# Altium project ARM_V2.PrjPcb
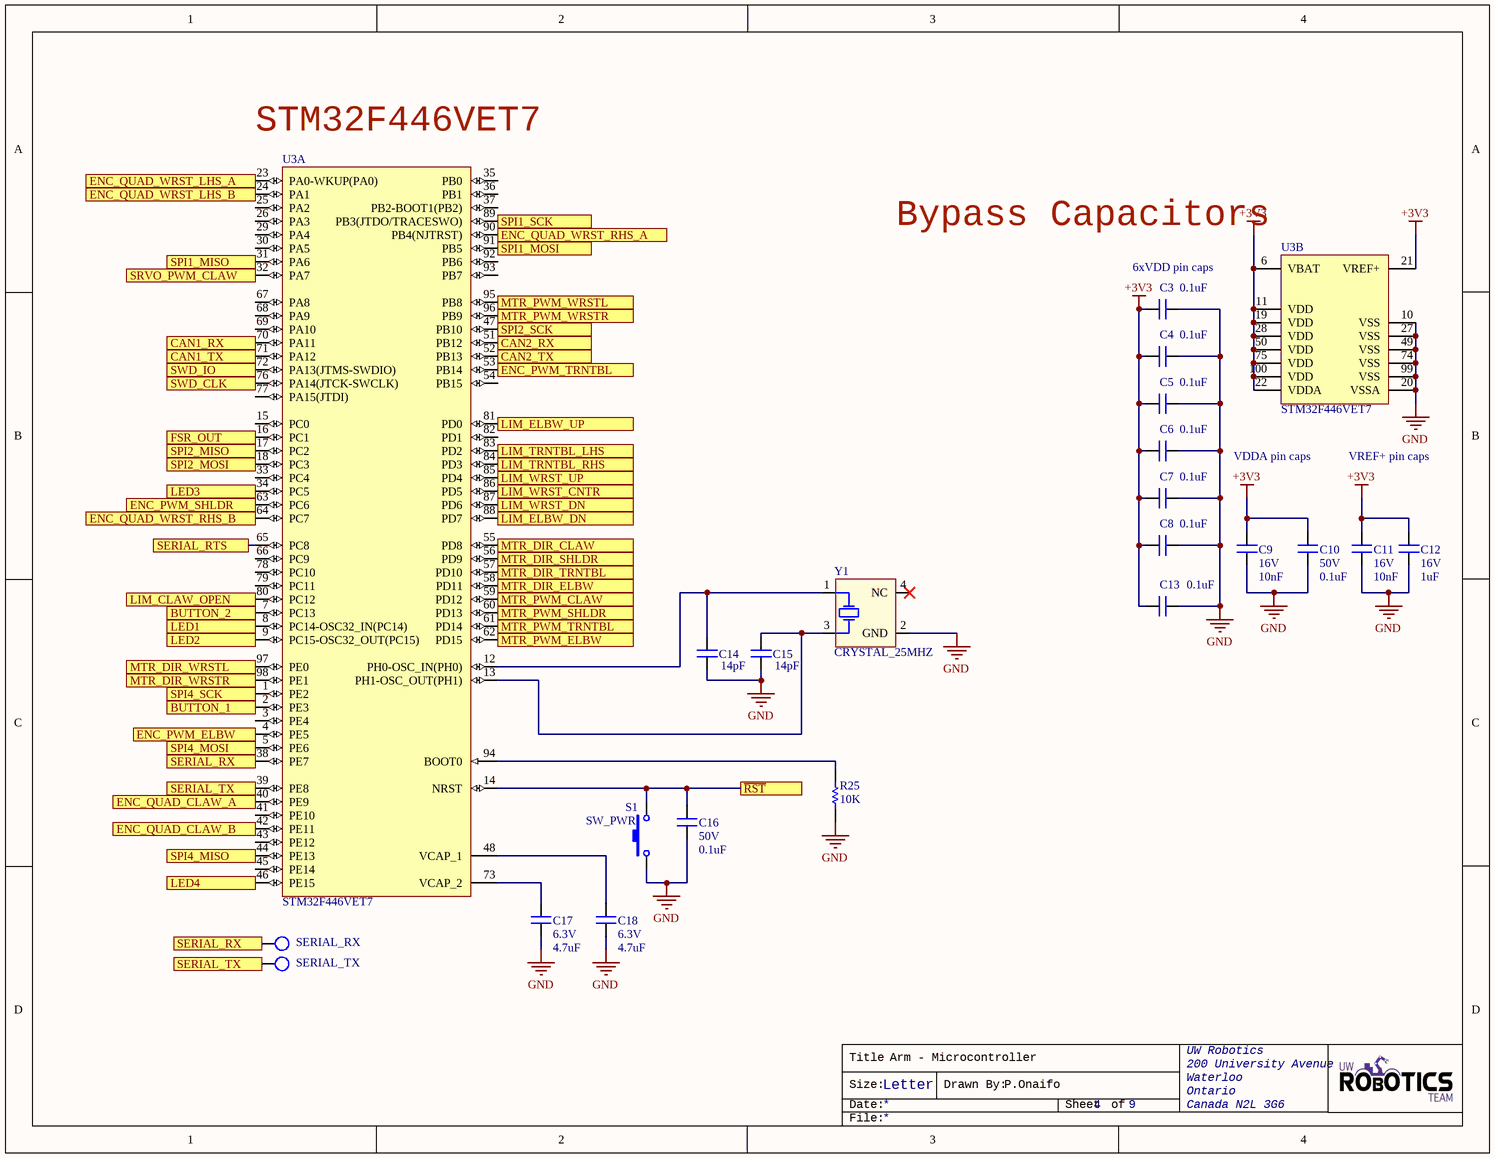
[diagram p0: MCU.SchDoc]
2 sheets, 28 parts. Net scope: flat (ports and power ports of the same name join across sheets).
Board file: ARM_V2.PcbDoc
Sheets:
  MCU.SchDoc
  Integrated Connectors.SchDoc

## Sheet MCU.SchDoc: Arm - Microcontroller
size Letter; DrawnBy: P.Onaifo; Organization: UW Robotics; Address1: 200 University Avenue; Address2: Waterloo; Address3: Ontario; Address4: Canada N2L 3G6; SheetNumber: 4; SheetTotal: 9

### Parts
C3  value 0.1uF  [CAPC0603(1608)55_N]  (hidden comment: CAP_0.1uF_50V_0603)
C4  value 0.1uF  [CAPC0603(1608)55_N]  (hidden comment: CAP_0.1uF_50V_0603)
C5  value 0.1uF  [CAPC0603(1608)55_N]  (hidden comment: CAP_0.1uF_50V_0603)
C6  value 0.1uF  [CAPC0603(1608)55_N]  (hidden comment: CAP_0.1uF_50V_0603)
C7  value 0.1uF  [CAPC0603(1608)55_N]  (hidden comment: CAP_0.1uF_50V_0603)
C8  value 0.1uF  [CAPC0603(1608)55_N]  (hidden comment: CAP_0.1uF_50V_0603)
C9  value 10nF  Voltage Rating: 16V  [CAPC0603(1608)55_N]  (hidden comment: CAP_10nF_0603)
C10  value 0.1uF  Voltage Rating: 50V  [CAPC0603(1608)55_N]  (hidden comment: CAP_0.1uF_50V_0603)
C11  value 10nF  Voltage Rating: 16V  [CAPC0603(1608)55_N]  (hidden comment: CAP_10nF_0603)
C12  value 1uF  Voltage Rating: 16V  [CAPC0603(1608)55_N]  (hidden comment: CAP_1uF_16V_0603)
C13  value 0.1uF  [CAPC0603(1608)55_N]  (hidden comment: CAP_0.1uF_50V_0603)
C14  value 14pF  (hidden comment: CAP_14pF_50V_0603)
C15  value 14pF  (hidden comment: CAP_14pF_50V_0603)
C16  value 0.1uF  Voltage Rating: 50V  [CAPC0603(1608)55_N]  (hidden comment: CAP_0.1uF_50V_0603)
C17  value 4.7uF  Voltage Rating: 6.3V  [CAPC0603(1608)55_N]  (hidden comment: CAP_4.7uF_0603)
C18  value 4.7uF  Voltage Rating: 6.3V  [CAPC0603(1608)55_N]  (hidden comment: CAP_4.7uF_0603)
R25  value 10K  [RESC0603(1608)_N]  (hidden comment: RES_10K_0603)
S1  SW_PWR  [PTS830GM140]
SERIAL_RX  TESTPOINT_LOOP  [TESTPOINT_LOOP]  (value not drawn)
SERIAL_TX  TESTPOINT_LOOP  [TESTPOINT_LOOP]  (value not drawn)
U3  STM32F446VET7  [STM-LQFP100_L]  (parts A,B of 2)
Y1  CRYSTAL_25MHZ

### Ports
BUTTON_1, BUTTON_2, CAN1_RX, CAN1_TX, CAN2_RX, CAN2_TX, ENC_PWM_ELBW, ENC_PWM_SHLDR, ENC_PWM_TRNTBL, ENC_QUAD_CLAW_A, ENC_QUAD_CLAW_B, ENC_QUAD_WRST_LHS_A, ENC_QUAD_WRST_LHS_B, ENC_QUAD_WRST_RHS_A, ENC_QUAD_WRST_RHS_B, FSR_OUT, LED1, LED2, LED3, LED4, LIM_CLAW_OPEN, LIM_ELBW_DN, LIM_ELBW_UP, LIM_TRNTBL_LHS, LIM_TRNTBL_RHS, LIM_WRST_CNTR, LIM_WRST_DN, LIM_WRST_UP, MTR_DIR_CLAW, MTR_DIR_ELBW, MTR_DIR_SHLDR, MTR_DIR_TRNTBL, MTR_DIR_WRSTL, MTR_DIR_WRSTR, MTR_PWM_CLAW, MTR_PWM_ELBW, MTR_PWM_SHLDR, MTR_PWM_TRNTBL, MTR_PWM_WRSTL, MTR_PWM_WRSTR, SERIAL_RTS, SERIAL_RX, SERIAL_TX, SPI1_MISO, SPI1_MOSI, SPI1_SCK, SPI2_MISO, SPI2_MOSI, SPI2_SCK, SPI4_MISO, SPI4_MOSI, SPI4_SCK, SRVO_PWM_CLAW, SWD_CLK, SWD_IO, ~{RST}

### Nets
+3V3: C3.1 C4.1 C5.1 C6.1 C7.1 C8.1 C9.2 C10.2 C11.1 C12.2 C13.1 U3.6(VBAT) U3.11(VDD) U3.19(VDD) U3.21(VREF+) U3.22(VDDA) U3.28(VDD) U3.50(VDD) U3.75(VDD) U3.100(VDD)
GND: C3.2 C4.2 C5.2 C6.2 C7.2 C8.2 C9.1 C10.1 C11.2 C12.1 C13.2 C14.1 C15.1 C16.1 C17.1 C18.1 R25.2 S1.1 U3.10(VSS) U3.20(VSSA) U3.27(VSS) U3.49(VSS) U3.74(VSS) U3.99(VSS) Y1.2(GND)
NetC14_2: C14.2 U3.12(PH0-OSC_IN(PH0)) Y1.1(HOT)
NetC15_2: C15.2 U3.13(PH1-OSC_OUT(PH1)) Y1.3(HOT)
NetC16_2: C16.2 S1.2 U3.14(NRST) ; port ~{RST}
NetC17_2: C17.2 U3.73(VCAP_2)
NetC18_2: C18.2 U3.48(VCAP_1)
NetR25_1: R25.1 U3.94(BOOT0)
NetSERIAL_RX_1: SERIAL_RX.1 U3.38(PE7) ; port SERIAL_RX
NetSERIAL_TX_1: SERIAL_TX.1 U3.39(PE8) ; port SERIAL_TX
NetU3_1: U3.1(PE2) ; port SPI4_SCK
NetU3_2: U3.2(PE3) ; port BUTTON_1
NetU3_4: U3.4(PE5) ; port ENC_PWM_ELBW
NetU3_5: U3.5(PE6) ; port SPI4_MOSI
NetU3_7: U3.7(PC13) ; port BUTTON_2
NetU3_8: U3.8(PC14-OSC32_IN(PC14)) ; port LED1
NetU3_9: U3.9(PC15-OSC32_OUT(PC15)) ; port LED2
NetU3_16: U3.16(PC1) ; port FSR_OUT
NetU3_17: U3.17(PC2) ; port SPI2_MISO
NetU3_18: U3.18(PC3) ; port SPI2_MOSI
NetU3_23: U3.23(PA0-WKUP(PA0)) ; port ENC_QUAD_WRST_LHS_A
NetU3_24: U3.24(PA1) ; port ENC_QUAD_WRST_LHS_B
NetU3_31: U3.31(PA6) ; port SPI1_MISO
NetU3_32: U3.32(PA7) ; port SRVO_PWM_CLAW
NetU3_34: U3.34(PC5) ; port LED3
NetU3_40: U3.40(PE9) ; port ENC_QUAD_CLAW_A
NetU3_42: U3.42(PE11) ; port ENC_QUAD_CLAW_B
NetU3_44: U3.44(PE13) ; port SPI4_MISO
NetU3_46: U3.46(PE15) ; port LED4
NetU3_47: U3.47(PB10) ; port SPI2_SCK
NetU3_51: U3.51(PB12) ; port CAN2_RX
NetU3_52: U3.52(PB13) ; port CAN2_TX
NetU3_53: U3.53(PB14) ; port ENC_PWM_TRNTBL
NetU3_55: U3.55(PD8) ; port MTR_DIR_CLAW
NetU3_56: U3.56(PD9) ; port MTR_DIR_SHLDR
NetU3_57: U3.57(PD10) ; port MTR_DIR_TRNTBL
NetU3_58: U3.58(PD11) ; port MTR_DIR_ELBW
NetU3_59: U3.59(PD12) ; port MTR_PWM_CLAW
NetU3_60: U3.60(PD13) ; port MTR_PWM_SHLDR
NetU3_61: U3.61(PD14) ; port MTR_PWM_TRNTBL
NetU3_62: U3.62(PD15) ; port MTR_PWM_ELBW
NetU3_63: U3.63(PC6) ; port ENC_PWM_SHLDR
NetU3_64: U3.64(PC7) ; port ENC_QUAD_WRST_RHS_B
NetU3_65: U3.65(PC8) ; port SERIAL_RTS
NetU3_70: U3.70(PA11) ; port CAN1_RX
NetU3_71: U3.71(PA12) ; port CAN1_TX
NetU3_72: U3.72(PA13(JTMS-SWDIO)) ; port SWD_IO
NetU3_76: U3.76(PA14(JTCK-SWCLK)) ; port SWD_CLK
NetU3_80: U3.80(PC12) ; port LIM_CLAW_OPEN
NetU3_81: U3.81(PD0) ; port LIM_ELBW_UP
NetU3_83: U3.83(PD2) ; port LIM_TRNTBL_LHS
NetU3_84: U3.84(PD3) ; port LIM_TRNTBL_RHS
NetU3_85: U3.85(PD4) ; port LIM_WRST_UP
NetU3_86: U3.86(PD5) ; port LIM_WRST_CNTR
NetU3_87: U3.87(PD6) ; port LIM_WRST_DN
NetU3_88: U3.88(PD7) ; port LIM_ELBW_DN
NetU3_89: U3.89(PB3(JTDO/TRACESWO)) ; port SPI1_SCK
NetU3_90: U3.90(PB4(NJTRST)) ; port ENC_QUAD_WRST_RHS_A
NetU3_91: U3.91(PB5) ; port SPI1_MOSI
NetU3_95: U3.95(PB8) ; port MTR_PWM_WRSTL
NetU3_96: U3.96(PB9) ; port MTR_PWM_WRSTR
NetU3_97: U3.97(PE0) ; port MTR_DIR_WRSTL
NetU3_98: U3.98(PE1) ; port MTR_DIR_WRSTR

Not connected (* = marked no-connect by the designer): U3 3(PE4) 15(PC0) 25(PA2) 26(PA3) 29(PA4) 30(PA5) 33(PC4) 35(PB0) 36(PB1) 37(PB2-BOOT1(PB2)) 41(PE10) 43(PE12) 45(PE14) 54(PB15) 66(PC9) 67(PA8) 68(PA9) 69(PA10) 77(PA15(JTDI)) 78(PC10) 79(PC11) 82(PD1) 92(PB6) 93(PB7); Y1 4(NC)*

### Notes on the sheet
- (near U3) STM32F446VET7
- Bypass Capacitors
- (near C3) 6xVDD pin caps
- VDDA pin caps
- VREF+ pin caps
- Title
- Size:
- Date:
- Letter
- Drawn By:
- Sheet
- of
- File:

### Library data of the parts
C3-C8 C10 C13 C16 = CAP_0.1uF_50V_0603: CAP CER 0.1UF 50V X7R 0603; MPN: CC0603KRX7R9BB104; Manufacturer: Yageo; Dimensions: 0.063" L x 0.031" W (1.60mm x 0.80mm); Package: 0603 (1608 Metric); Temperature Coefficient: X7R; Supplier Part Number 1: 311-1344-1-ND; Supplier 1: Digi-Key
  C3-C8 C13: Voltage Rating: 50V
C9 C11 = CAP_10nF_0603: CAP CER 10000PF 16V X7R 0603; MPN: CC0603KRX7R7BB103; Manufacturer: Yageo; Dimensions: 0.063" L x 0.031" W (1.60mm x 0.80mm); Package: 0603 (1608 Metric); Temperature Coefficient: X7R; Supplier Part Number 1: 311-3369-1-ND; Supplier 1: Digi-Key
C12 = CAP_1uF_16V_0603: CAP CER 1UF 16V Y5V 0603; MPN: CC0603ZRY5V7BB105; Manufacturer: Yageo; Dimensions: 0.063" L x 0.031" W (1.60mm x 0.80mm); Package: 0603 (1608 Metric); Temperature Coefficient: Y5V; Supplier Part Number 1: 311-1372-1-ND; Supplier 1: Digi-Key
C14 C15 = CAP_14pF_50V_0603: CAP CER 14PF 50V C0G/NP0 0603; Manufacturer 1: Samsung; Manufacturer Part Number 1: CL10C140JB8NNNC; Tolerance: 5%; Dielectric: C0G; Voltage Rating: 50V; Supplier Part Number 1: 1276-2187-1-ND; Supplier 1: Digi-Key; Stock 1: 187088; Pricing 1: 1=0.10000, 10=0.06700, 100=0.02980, 500=0.02130, 1000=0.01673 (USD); RoHS: Yes; Mount: Surface Mount; Case/Package: 0603; Case Code (Metric): 1608; Case Code (Imperial): 0603; Min Operating Temperature: -55°C; Max Operating Temperature: 125°C; Package Quantity: 1; Packaging: Tape and Reel; Voltage Rating (DC): 50V; Length: 1.6mm; Height: 0.8mm; Width: 0.031inch; Depth: 0.8mm; Thickness: 0.035inch; Radiation Hardening: No; ComponentLink1URL: https://datasheet.ciiva.com/25782/cl10c140jb8nnnc-25782947.pdf?src-supplier=Digi-Key; ComponentLink1Description: https://datasheet.ciiva.com/25782/cl10c140jb8nnnc-25782947.pdf?src-supplier=Digi-Key; Capacitance: 14pF
C17 C18 = CAP_4.7uF_0603: CAP CER 4.7UF 6.3V X5R 0603; MPN: CC0603KRX5R5BB475; Manufacturer: Yageo; Dimensions: 0.063" L x 0.031" W (1.60mm x 0.80mm); Package: 0603 (1608 Metric); Temperature Coefficient: X5R; Supplier Part Number 1: 311-1521-1-ND; Supplier 1: Digi-Key
R25 = RES_10K_0603: RES SMD 10K OHM 5% 1/10W 0603; Manufacturer: Yageo; MPN: RC0603JR-0710KL; Package: 0603 (1608 Metric); Dimensions: 0.063" L x 0.031" W (1.60mm x 0.80mm); Tolerance: 5%; Supplier Part Number 1: 311-10KGRCT-ND; Supplier 1: Digi-Key
S1 = SW_PWR: Power Switch (Red); pin to pad: 2>4; MPN: PTS830GM140 SMTR LFS; Manufacturer: C&K; ComponentLink1Description: Datasheet; ComponentLink1URL: https://www.ckswitches.com/media/1478/pts830.pdf; Supplier Part Number 1: CKN10587CT-ND; Supplier 1: Digi-Key
SERIAL_RX SERIAL_TX = TESTPOINT_LOOP: Loop testpoint through-hole pad; Manufacturer: Keystone Electronics; Manufacturer Part Number 1: 5002; Supplier Part Number 1: 36-5002-ND; Supplier 1: Digi-Key
U3 = CMP-0243-00221-1: ARM Cortex-M4 32-bit MCU+FPU, 512 KB Flash, 128 KB Internal RAM, 81 I/Os, 100-Pin LQFP, -40 to 105 degC, Tray; Supply Voltage(Vcc) min (V): 1.7; Operating Frequency(F) (Processor speed) (MHz): 180; D/A Converter: 2; FLASH Size (Prog) (kB): 512; I/Os (High Current): 81; Internal RAM Size (kB): 128; Core: ARM Cortex-M4; Packing: Tray; ComponentLink1URL: http://www.st.com/; DatasheetVersion: Rev. 6; Mounting Technology: Surface Mount; ComponentLink2Description: Datasheet; ComponentLink2URL: http://www.st.com/st-web-ui/static/active/en/resource/technical/document/datasheet/DM00141306.pdf; Package Reference: 100-Pin Low Profile Quad Flat Package, Body 14 x 14 mm, Pitch 0.5 mm; ComponentLink1Description: Manufacturer URL; Package Description: LQFP100
Y1 = CRYSTAL_25MHZ: CRYSTAL 25.0000MHZ 12PF SMD; Manufacturer 1: Kyocera AVX; Manufacturer Part Number 1: CX2520DB25000H0FLJC1; Frequency: 25MHz; ESR (Equivalent Series Resistance): 80R; Frequency Stability: 15ppm; Frequency Tolerance: 10ppm; ComponentLink1Description: https://media.digikey.com/pdf/Data%20Sheets/AVX%20PDFs/CX2520DB_USY1M-H1-16429-00_Spec.pdf?src-supplier=Digi-Key; ComponentLink1URL: https://media.digikey.com/pdf/Data%20Sheets/AVX%20PDFs/CX2520DB_USY1M-H1-16429-00_Spec.pdf?src-supplier=Digi-Key; Supplier 1: Digi-Key; Supplier Part Number 1: 1253-1724-1-ND; Stock 1: 11741; Pricing 1: 1=0.72000, 10=0.63300, 50=0.59120, 100=0.52250, 500=0.49500, 1000=0.41250 (USD); RoHS: Yes; Mount: Surface Mount; Case/Package: SMD/SMT; Min Operating Temperature: -30°C; Max Operating Temperature: 85°C; Packaging: Tape and Reel; Load Capacitance: 12pF; Length: 0.098inch; Height: 0.022inch; Width: 0.079inch; Ratings: AEC-Q200

## Sheet Integrated Connectors.SchDoc
size Letter
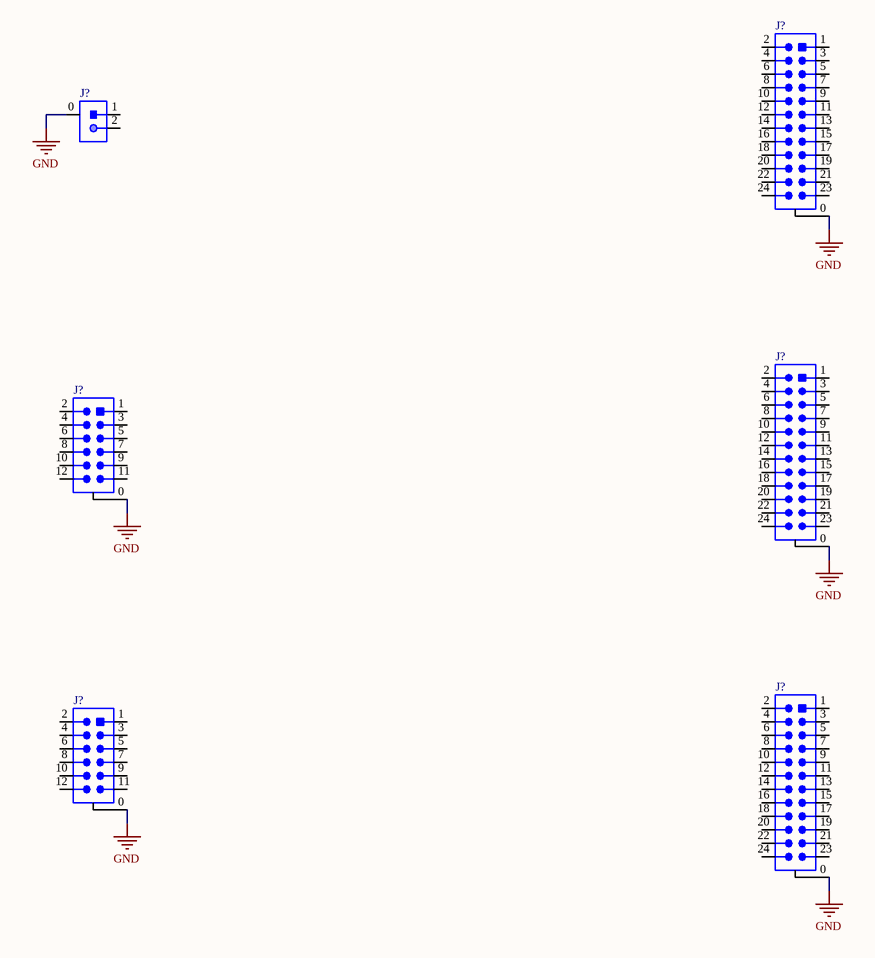
[diagram p1: Integrated Connectors.SchDoc]

### Parts
(Parts that share a designator on the sheet are numbered #1, #2 ... from top to bottom, then left to right.)
J?#1  CON_2M_SM_RA  [MOLEX-5024940270]  (value not drawn)
J?#2  CON_12x2M_SM_RA  [MOLEX-5031482490]  (value not drawn)
J?#3  CON_6x2M_SM_RA  [MOLEX-5031481290]  (value not drawn)
J?#4  CON_12x2M_SM_RA  [MOLEX-5031482490]  (value not drawn)
J?#5  CON_6x2M_SM_RA  [MOLEX-5031481290]  (value not drawn)
J?#6  CON_12x2M_SM_RA  [MOLEX-5031482490]  (value not drawn)

### Nets
GND: J?#1.0 J?#2.0 J?#3.0 J?#4.0 J?#5.0 J?#6.0

Not connected (* = marked no-connect by the designer): J?#1 1 2; J?#2 1 2 3 4 5 6 7 8 9 10 11 12 13 14 15 16 17 18 19 20 21 22 23 24; J?#3 1 2 3 4 5 6 7 8 9 10 11 12; J?#4 1 2 3 4 5 6 7 8 9 10 11 12 13 14 15 16 17 18 19 20 21 22 23 24; J?#5 1 2 3 4 5 6 7 8 9 10 11 12; J?#6 1 2 3 4 5 6 7 8 9 10 11 12 13 14 15 16 17 18 19 20 21 22 23 24

### Notes on the sheet
- Title
- Size:
- Date:
- Letter
- Drawn By:
- Sheet
- of
- File:

### Library data of the parts
J?#1 = CON_2M_SM_RA: CONN HEADER SMD RIGHT ANGLE 2MM PITCH; Manufacturer 1: Molex; Manufacturer Part Number 1: 5024940270; Connector Type: Receptacle,Forked; Number of Positions: 2; Supplier 1: Digi-Key; Stock 1: 3397; Pricing 1: 1=0.53000, 10=0.49400, 25=0.44440, 50=0.39500, 100=0.37850, 250=0.34556 (USD); RoHS: No; Mount: Surface Mount; Contact Plating: Tin; Insulation Color: Natural; Insulation Material: Resin; Min Operating Temperature: -40°C; Max Operating Temperature: 105°C; Fastening Type: Latch; Packaging: Tape and Reel; Number of Rows: 1; Termination: Solder; Flammability Rating: UL94 V-0; ComponentLink1URL: https://www.molex.com/pdm_docs/as/AS-502439-002-001.pdf?src-supplier=Digi-Key; ComponentLink1Description: https://www.molex.com/pdm_docs/as/AS-502439-002-001.pdf?src-supplier=Digi-Key; Supplier Part Number 1: WM15810CT-ND
J?#2 J?#4 J?#6 = CON_12x2M_SM_RA: CONN HEADER SMD RIGHT ANGLE 1.5MM PITCH
J?#3 J?#5 = CON_6x2M_SM_RA: CONN HEADER SMD RIGHT ANGLE 1.5MM PITCH; Manufacturer 1: Molex; Manufacturer Part Number 1: 5031481290; Number of Circuits: 12; Voltage Rating: 100V; Current Rating: 1A; Connector Type: Receptacle,Center Strip Contact; Gender: Receptacle; Glow Wire Compliant: Non-compliant; Supplier 1: Digi-Key; Stock 1: 276; Pricing 1: 1=1.86000, 10=1.68800, 100=1.44720 (USD); RoHS: Yes; Mount: Surface Mount,Through Hole; Contact Plating: Tin; Contact Material: Copper Alloy,Copper,Tin; Housing Color: Beige; Color: Beige; Housing Material: Resin; Min Operating Temperature: -25°C; Max Operating Temperature: 85°C; Packaging: Tape and Reel; Orientation: Right Angle; Number of Rows: 2; Package Quantity: 550; Fastening Type: Latch; Contact Gender: Female; Number of Positions: 12; Termination: Solder; Number of Contacts: 12; Length: 13.3mm; Pitch: 1.5mm; Depth: 9.55mm; Radiation Hardening: No; REACH SVHC: Unknown; ComponentLink1URL: https://datasheet.ciiva.com/756/5031481090-sd-756828.pdf?src-supplier=Digi-Key; ComponentLink1Description: https://datasheet.ciiva.com/756/5031481090-sd-756828.pdf?src-supplier=Digi-Key; ComponentLink2URL: https://datasheet.ciiva.com/10083/5031481290-pcb-receptacles-10083012.pdf?src-supplier=Avnet; ComponentLink2Description: https://datasheet.ciiva.com/10083/5031481290-pcb-receptacles-10083012.pdf?src-supplier=Avnet; ComponentLink3URL: https://datasheet.ciiva.com/30261/68305031481290-pcb-receptacles-30261716.pdf?src-supplier=Onlinecomponents.com; ComponentLink3Description: https://datasheet.ciiva.com/30261/68305031481290-pcb-receptacles-30261716.pdf?src-supplier=Onlinecomponents.com; ComponentLink4URL: https://datasheet.ciiva.com/5162/5031481290-pcb-receptacles-179578-5162271.pdf?src-supplier=Mouser; ComponentLink4Description: https://datasheet.ciiva.com/5162/5031481290-pcb-receptacles-179578-5162271.pdf?src-supplier=Mouser; ComponentLink5URL: https://datasheet.ciiva.com/14155/503148-eng-tds-14155950.pdf?src-supplier=Distrelec; ComponentLink5Description: https://datasheet.ciiva.com/14155/503148-eng-tds-14155950.pdf?src-supplier=Distrelec; Supplier Part Number 1: WM14476CT-ND

## Nets that join several sheets
GND: MCU (25 pins), Integrated Connectors (6 pins)